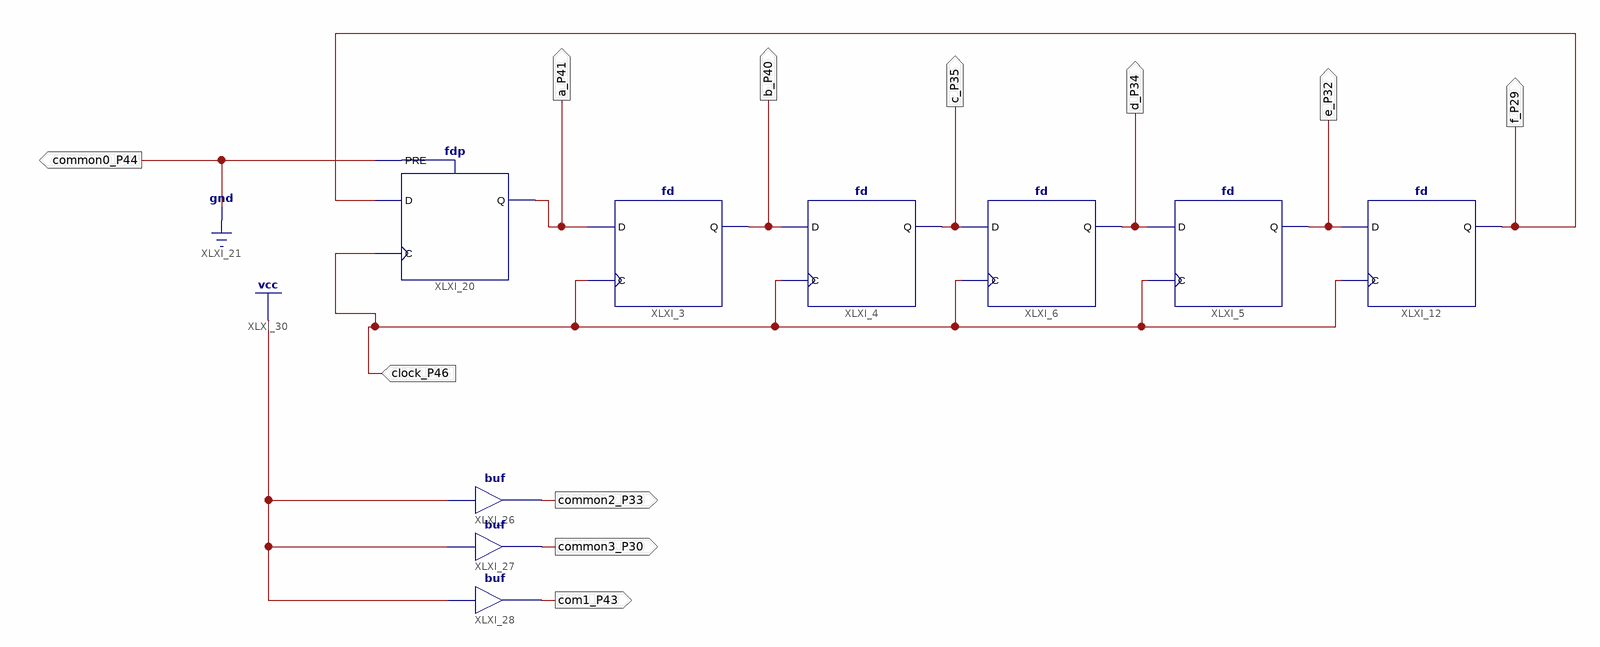
[diagram p0: schematic sheet 1]
// Xilinx ISE schematic Lab7.sch (spartan6) as structural Verilog: 9 symbols, 11 ports
module Lab7 (
  input  clock_P46,
  output b_P40,
  output c_P35,
  output d_P34,
  output e_P32,
  output a_P41,
  output f_P29,
  output common2_P33,
  output common3_P30,
  output com1_P43,
  output common0_P44
);

  fd XLXI_3 (.C(clock_P46), .D(a_P41), .Q(b_P40));
  fd XLXI_4 (.C(clock_P46), .D(b_P40), .Q(c_P35));
  fd XLXI_6 (.C(clock_P46), .D(c_P35), .Q(d_P34));
  fd XLXI_5 (.C(clock_P46), .D(d_P34), .Q(e_P32));
  fd XLXI_12 (.C(clock_P46), .D(e_P32), .Q(f_P29));
  fdp XLXI_20 (.C(clock_P46), .D(f_P29), .PRE(1'b0), .Q(a_P41));
  buf XLXI_26 (common2_P33, 1'b1);
  buf XLXI_27 (common3_P30, 1'b1);
  buf XLXI_28 (com1_P43, 1'b1);

  assign common0_P44 = 1'b0;
endmodule
